# EAGLE design bpod_stepper (EAGLE 9.6.2)
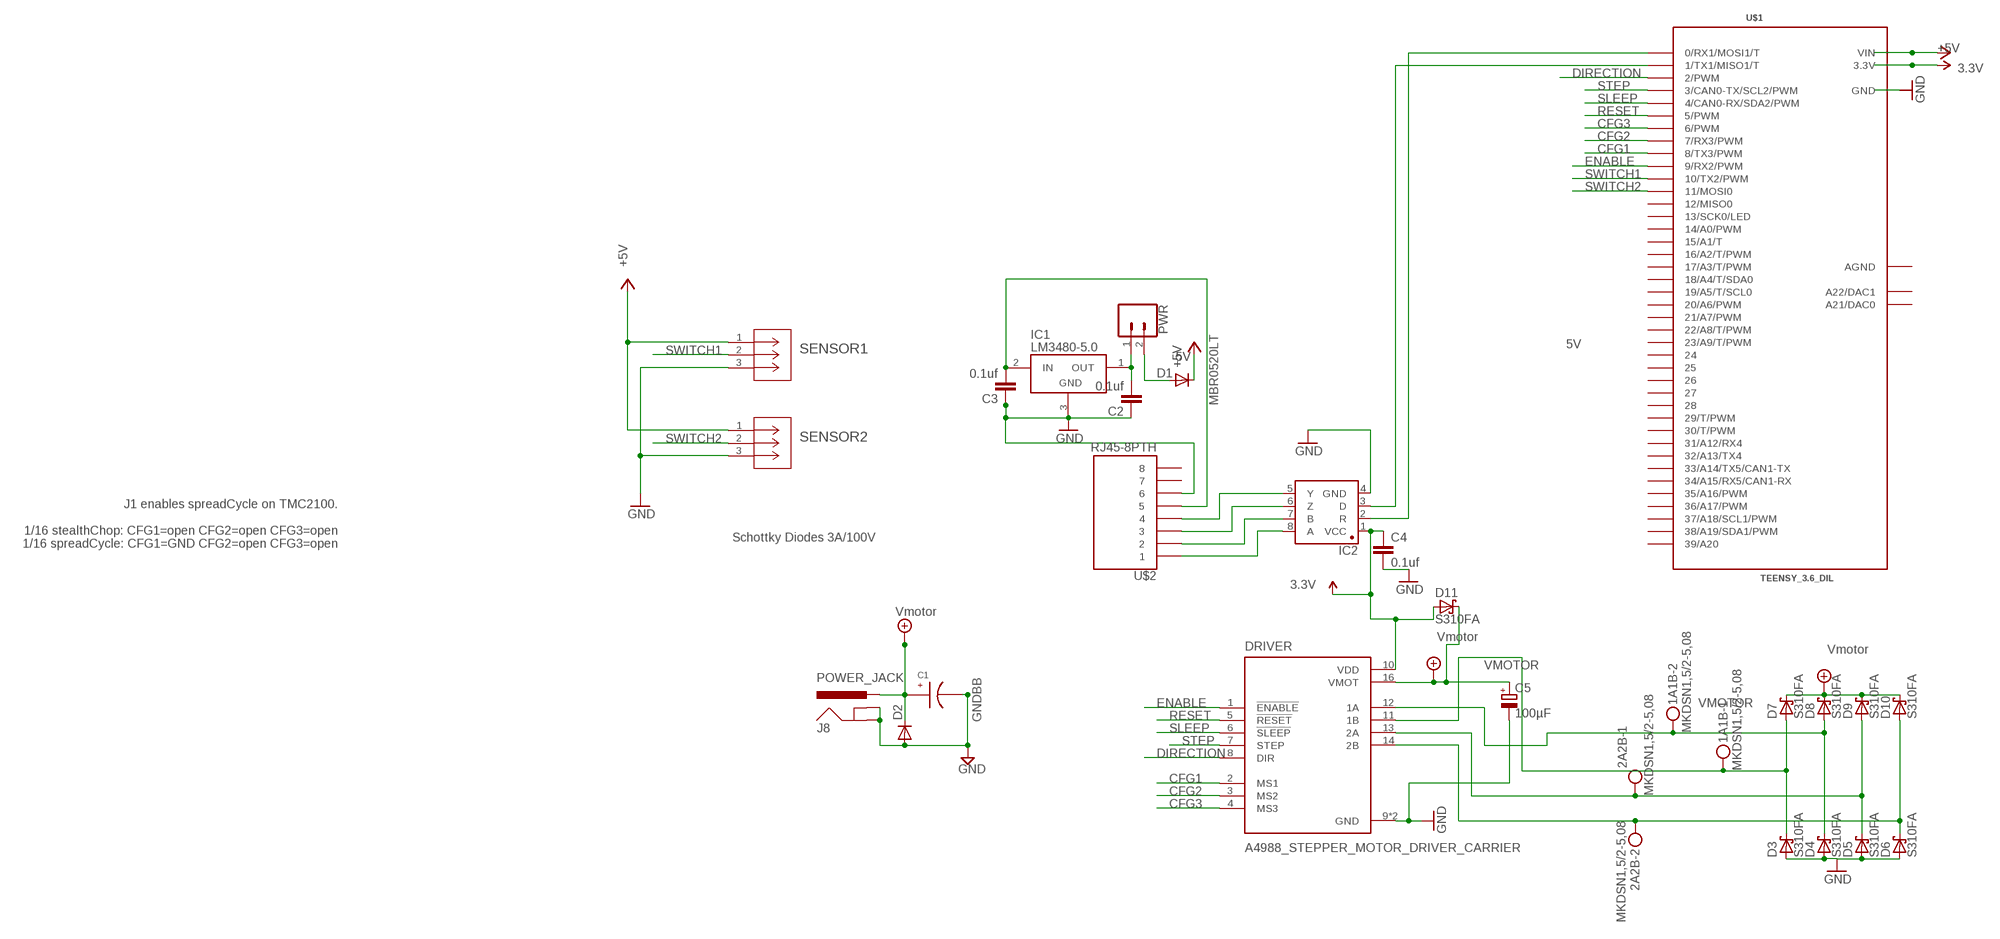
[diagram p0: schematic, sheet 1]

## Parts
1A1B  MKDSN1,5/2-5,08  [MKDSN1,5/2-5,08]
2A2B  MKDSN1,5/2-5,08  [MKDSN1,5/2-5,08]
C1  EEE-FK1H100UR  [EEE-FK1H100UR]
C2  0.1uf  CAP1206  [1206@1]
C3  0.1uf  CAP1206  [1206@1]
C4  0.1uf  CAP1206  [1206@1]
C5  100µF  CPOL-EUE2,5-6E  [E2,5-6E]
D1  MBR0520LT  [SOD123]
D2  DIODE-DO214AA  [DO214AA]
D3  S310FA  D_SCHOTTKY-SOD123  [SOD123]
D4  S310FA  D_SCHOTTKY-SOD123  [SOD123]
D5  S310FA  D_SCHOTTKY-SOD123  [SOD123]
D6  S310FA  D_SCHOTTKY-SOD123  [SOD123]
D7  S310FA  D_SCHOTTKY-SOD123  [SOD123]
D8  S310FA  D_SCHOTTKY-SOD123  [SOD123]
D9  S310FA  D_SCHOTTKY-SOD123  [SOD123]
D10  S310FA  D_SCHOTTKY-SOD123  [SOD123]
D11  S310FA  D_SCHOTTKY-SOD123  [SOD123]
DRIVER  A4988_STEPPER_MOTOR_DRIVER_CARRIER  [MODULE_A4988_STEPPER_MOTOR_DRIVER_CARRIER]
IC1  LM3480-5.0  [SOT-23-3]
IC2  SN65HVD31DR  [SO08]
J8  POWER_JACK  [POWER_JACK_PTH]
PWR  CONN_02  [1X02]
SENSOR1  282834-3  [CONN_282834-3_TYC]
SENSOR2  282834-3  [CONN_282834-3_TYC]
U$1  TEENSY_3.6_DIL  [TEENSY_3.6_DIL]
U$2  RJ45-8PTH  [RJ45-8]

## Nets
3.3V: C4.1 D11.A DRIVER.10(VDD) IC2.1(VCC) U$1.3.3V U$1.3.3V3(3.3V)
+5V: D1.C SENSOR1.1 SENSOR2.1 U$1.VIN
CFG1: DRIVER.2(MS1) U$1.8(8/TX3/PWM)
CFG2: DRIVER.3(MS2) U$1.7(7/RX3/PWM)
CFG3: DRIVER.4(MS3) U$1.6(6/PWM)
DIRECTION: DRIVER.8(DIR) U$1.2(2/PWM)
ENABLE: DRIVER.1(!ENABLE) U$1.9(9/RX2/PWM)
GND: C1.CATHODE C2.1 C3.1 C4.2 C5.- D2.A D3.A D4.A D5.A D6.A DRIVER.9(GND) DRIVER.15(GND) IC1.3(GND) IC2.4(GND) J8.GND J8.GNDBREAK SENSOR1.3 SENSOR2.3 U$2.6
M1A1: 1A1B.1 D3.C D7.A DRIVER.11(1B)
M1B1: 1A1B.2 D4.C D8.A DRIVER.12(1A)
M2A1: 2A2B.1 D5.C D9.A DRIVER.13(2A)
M2B1: 2A2B.2 D6.C D10.A DRIVER.14(2B)
N$7: IC2.8(A) U$2.1
N$8: IC2.7(B) U$2.2
N$9: IC2.6(Z) U$2.3
N$10: IC2.5(Y) U$2.4
N$14: C2.2 IC1.1(OUT) PWR.1
N$18: D1.A PWR.2
N$24: C3.2 IC1.2(IN) U$2.5
RESET: DRIVER.5(!RESET) U$1.5(5/PWM)
RX1: IC2.2(R) U$1.0(0/RX1/MOSI1/T)
SLEEP: DRIVER.6(!SLEEP) U$1.4(4/CAN0-RX/SDA2/PWM)
STEP: DRIVER.7(STEP) U$1.3(3/CAN0-TX/SCL2/PWM)
SWITCH1: SENSOR1.2 U$1.10(10/TX2/PWM)
SWITCH2: SENSOR2.2 U$1.11(11/MOSI0)
TX1: IC2.3(D) U$1.1(1/TX1/MISO1/T)
VMOTOR: C1.ANODE C5.+ D2.C D7.C D8.C D9.C D10.C D11.C DRIVER.16(VMOT) J8.PWR ; supply symbol labelled Vmotor
Unconnected: U$1.12(12/MISO0) U$1.13(13/SCK0/LED) U$1.14/A0(14/A0/PWM) U$1.15/A1(15/A1/T) U$1.16/A2(16/A2/T/PWM) U$1.17/A3(17/A3/T/PWM) U$1.18/A4(18/A4/T/SDA0) U$1.19/A5(19/A5/T/SCL0) U$1.20/A6(20/A6/PWM) U$1.21/A7(21/A7/PWM) U$1.22/A8(22/A8/T/PWM) U$1.23/A9(23/A9/T/PWM) U$1.24 U$1.25 U$1.26 U$1.27 U$1.28 U$1.29(29/T/PWM) U$1.30(30/T/PWM) U$1.31/A12(31/A12/RX4) U$1.32/A13(32/A13/TX4) U$1.33/A14(33/A14/TX5/CAN1-TX) U$1.34/A15(34/A15/RX5/CAN1-RX) U$1.35/A16(35/A16/PWM) U$1.36/A17(36/A17/PWM) U$1.37/A18(37/A18/SCL1/PWM) U$1.38/A19(38/A19/SDA1/PWM) U$1.39/A20 U$1.A21(A21/DAC0) U$1.A22(A22/DAC1) U$2.7 U$2.8

## Notes on the sheet
- 5V
- 5V
- J1 enables spreadCycle on TMC2100.
  
  1/16 stealthChop: CFG1=open CFG2=open CFG3=open
  1/16 spreadCycle: CFG1=GND CFG2=open CFG3=open
- Schottky Diodes 3A/100V
- GNDBB

## Power pins joined to a net without a drawn wire
AGND: U$1.AGND
GND: U$1.GND U$1.GND1(GND)

## Library data of the parts
1A1B 2A2B = con-phoenix-508:MKDSN1,5/2-5,08: MKDSN 1,5/ 2-5,08 Printklemme Nennstrom: 13,5 A Nennspannung: 250 V Rastermaß: 5,08 mm Polzahl: 2 Anschlussart: Schraubanschluss Montage: Löten Anschlussrichtung Leiter/Platine: 0 ° Artikelnummer: 1729128 Source: http://eshop.phoenixcontact.com .. 1729128.pdf
C1 = JoshParts10:EEE-FK1H100UR
C2-C4 = SparkFun-Capacitors:CAP: Capacitor Standard 0603 ceramic capacitor, and 0.1" leaded capacitor.
C5 = rcl:CPOL-EU: POLARIZED CAPACITOR, European symbol; SPICEPREFIX: C
D1 = diode:MBR0520LT: SCHOTTKY BARRIER RECTIFIER Source: http://onsemi.com .. MBR0520LT1-D.pdf
D2 = diode:DIODE-: DIODE
D3-D11 = we-rcl:D_SCHOTTKY: Schottky Diodes 1A, 30V - SOD323 (BAS3010 or CUS10S40) 2A, 30V - SMA/DO214AC 10A,45V - Z5-T (CDBZ5T1045)
DRIVER = A4988_STEPPER_MOTOR_DRIVER_CARRIER:A4988_STEPPER_MOTOR_DRIVER_CARRIER: Stepper motor controler; IC: A4988; 1A; Uin mot: 8÷35V; AVAILABILITY: Unavailable; DESCRIPTION: Stepper Motor Driver; MF: Pololu; MP: A4988 STEPPER MOTOR DRIVER CARRIER; PACKAGE: None; PRICE: None
IC1 = regulators:LM3480-*: National Semiconductor LM3480 100 mA, SOT-23, quasi-LDO linear regulator
IC2 = Joshparts4:SN65HVD31DR: A placeholder for generic narrow & wide SOIC8 foorptints - used on the DIP adapter board.
J8 = SparkFun-Connectors:POWER_JACK: Power Jack Connector This is the standard 5.5mm barrel jack for power. The PTH is the most common, proven, reliable, footprint. The Slot footprint only works if the mill layer is transmitted to the PCB fab house so be warned. Here are the connectors we sell at SparkFun: DC Barrel Power Jack/Connector <https://www.sparkfun.com/products/119> (PRT-00119) DC Barrel Power Jack/Connector (SMD) <https://www.sparkfun.com/products/12748> (PRT-12748) DC Barrel Jack Adapter - Breadboard Compatible <https://www.sparkfun.com/products/10811> (PRT-10811) It is used on this SparkFun product (and many, many others): SparkFun RedBoard - Programmed with Arduino <https://www.sparkfun.com/products/12757> (DEV-12757) Also, if you need a mating power supply or connector, please check these out: Wall Adapter Power Supply - 9VDC 650mA <https://www.sparkfun.com/products/298> (TOL-00298) DC Barrel Jack Adapter - Male <https://www.sparkfun.com/products/10287> (PRT-10287); PROD_ID: CONN-08197
PWR = SparkFun-Connectors:CONN_02: Multi connection point. Often used as Generic Header-pin footprint for 0.1 inch spaced/style header connections On any of the 0.1 inch spaced packages, you can populate with these: Break Away Headers - Straight <https://www.sparkfun.com/products/116> (PRT-00116) Break Away Male Headers - Right Angle <https://www.sparkfun.com/products/553> (PRT-00553) Female Headers <https://www.sparkfun.com/products/115> (PRT-00115) Break Away Headers - Machine Pin <https://www.sparkfun.com/products/117> (PRT-00117) Break Away Female Headers - Swiss Machine Pin <https://www.sparkfun.com/products/743> (PRT-00743) For SCREWTERMINALS and SPRING TERMINALS visit here: Screw Terimnals on SparkFun.com <https://www.sparkfun.com/search/results?term=Screw+Terminals> (5mm/3.5mm/2.54mm spacing) This device is also useful as a general connection point to wire up your design to another part of your project. Our various solder wires solder well into these plated through hole pads. Hook-Up Wire - Assortment (Stranded, 22 AWG) <https://www.sparkfun.com/products/11375> (PRT-11375) Hook-Up Wire - Assortment (Solid Core, 22 AWG) <https://www.sparkfun.com/products/11367> (PRT-11367) View the entire wire category on our website here <https://www.sparkfun.com/categories/141> Special notes: Molex polarized connector foot print use with: PRT-08233 with associated crimp pins and housings. 2.54_SCREWTERM for use with PRT-10571. 3.5mm Screw Terminal footprints for PRT-08084 5mm Screw Terminal footprints for use with PRT-08432
SENSOR1 SENSOR2 = 254mm 3pin Schraubterminal:282834-3; BUILT_BY: EMA_UL_Team; COPYRIGHT: Copyright (C) 2016 Accelerated Designs. All rights reserved; MANUFACTURER_PART_NUMBER: 282834-3; SOURCELIBRARY: Tyco_2012-06-25; VENDOR: TE Connectivity
U$1 = Teensy_3_and_LC_Series_Boards_v1.4:TEENSY_3.6_DIL: Teensy 3.6 DIL Package
U$2 = SparkFun:RJ45-8: RJ45 Jack Simple RJ45, 8-pin connection - connector for common Cat5, Cat5e, and Cat6 Ethernet cables. Footprint not yet proven in production. Connector sku is PRT-00643; Breakout PCB sku is BOB-00716.

## Board
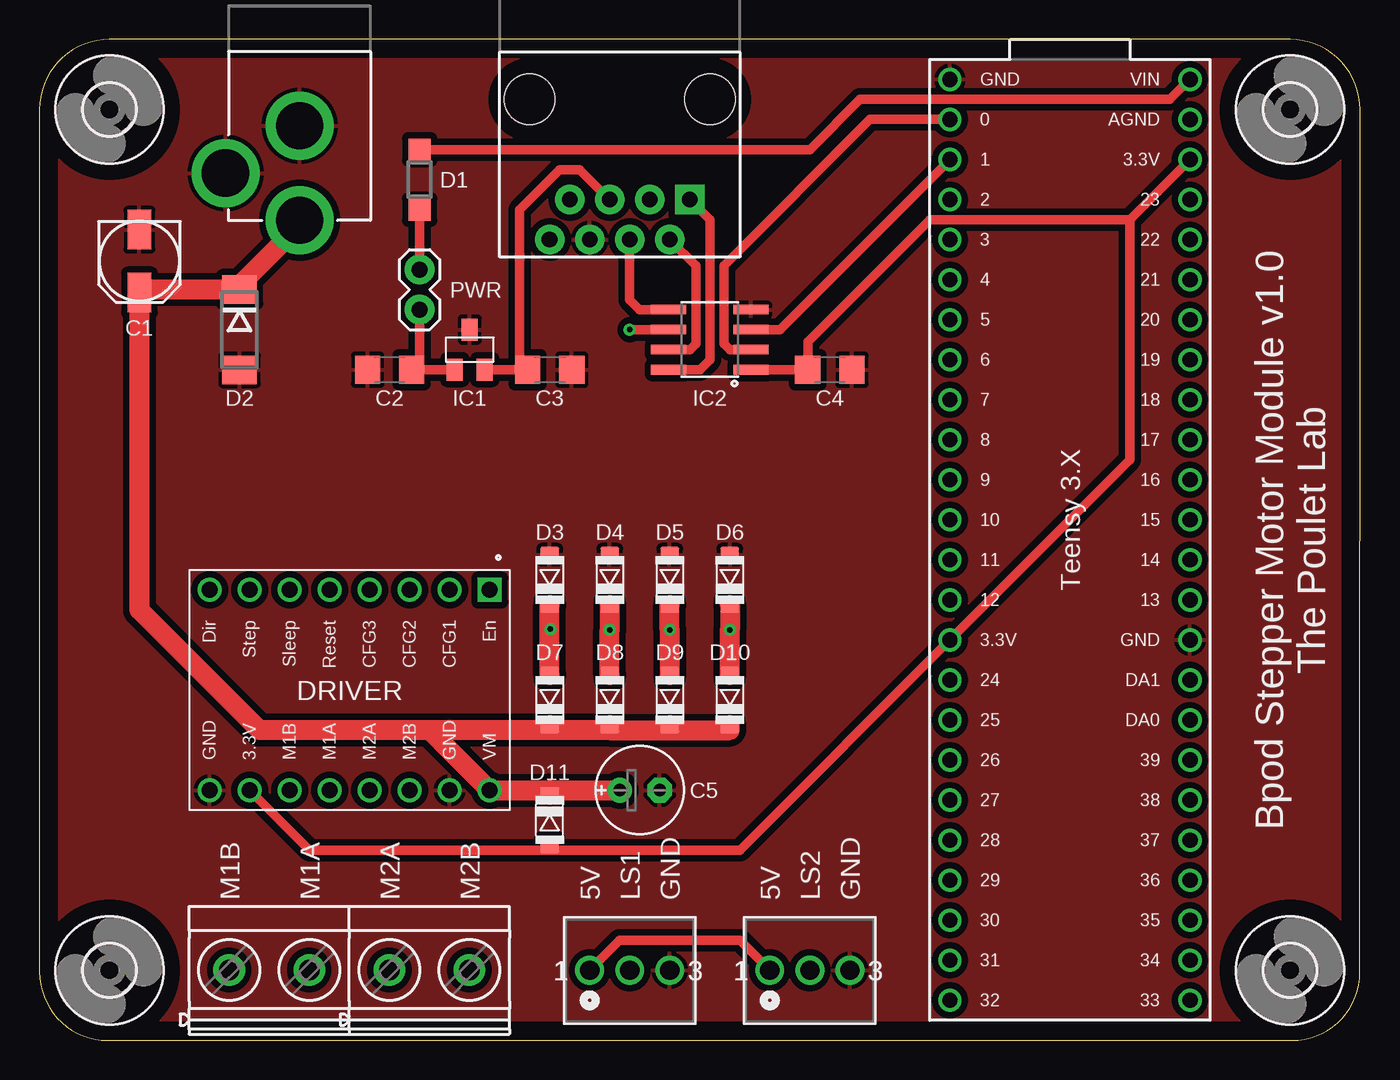
[diagram p1: board, top side]
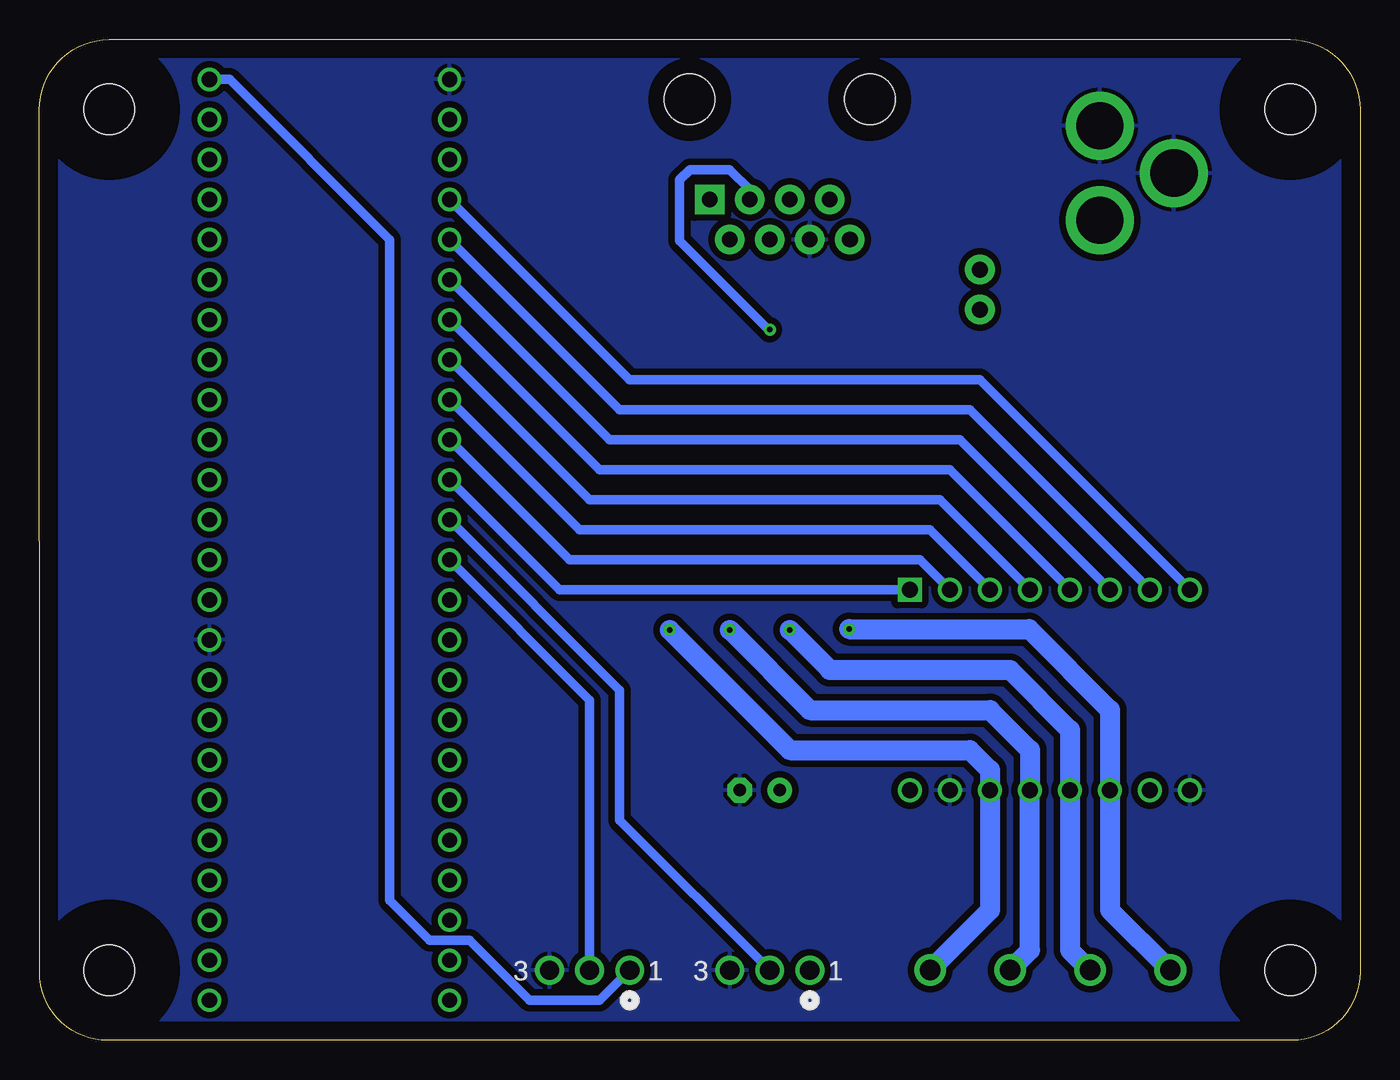
[diagram p2: board, bottom side, seen from below]

Size 83.82 x 63.5 mm. Coordinates in mm from the lower left corner, seen from the top.
Outline: 79.38,63.5 4.45,63.5 arc90 0,59.05 0,4.34 arc90 4.34,0 79.5,0 arc90 83.8,4.3 83.82,59.05 arc90 79.38,63.5
Copper layers (1*16): Top 0.035mm / dielectric 1.5mm / Bottom 0.035mm
Design rules "default": minimum track width 6mil, minimum drill 0.35mm, track to track 6mil, track to pad 6mil, pad to pad 6mil, via to via 6mil, smd to smd 6mil, copper to edge 40mil, drill to drill 6mil, minimum pad ring 10mil, minimum via ring 8mil, stop-mask expansion 4mil, vias tented up to drill 0mil, thermal gap 10mil

### Footprints (pad centres in the part's own frame; a part is rotated, then mirrored left to right if it is on the bottom)
MKDSN1,5/2-5,08 = drill 1.3 pad 2: 1 -2.561,0.025; 2 2.519,0.025
EEE-FK1H100UR = smd 1.5 x 2.5: ANODE 0,4; CATHODE 0,0
1206@1 = smd 1.6 x 1.8: 1 -1.4,0; 2 1.4,0
E2,5-6E = drill 0.813 pad 1.575: + -1.27,0 | drill 0.813 pad 1.575 octagon: - 1.27,0
SOD123 = smd 1.4 x 1.4: A 1.9,0; C -1.9,0
DO214AA = smd 1.8 x 2.2: A 2.55,0; C -2.55,0
SOD123' = smd 1.2 x 1: A 0,-1.6; C 0,1.6
MODULE_A4988_STEPPER_MOTOR_DRIVER_CARRIER = drill 1.02 square: 1 -6.35,8.89 | drill 1.02: 2 -6.35,6.35; 3 -6.35,3.81; 4 -6.35,1.27; 5 -6.35,-1.27; 6 -6.35,-3.81; 7 -6.35,-6.35; 8 -6.35,-8.89; 9 6.35,-8.89; 10 6.35,-6.35; 11 6.35,-3.81; 12 6.35,-1.27; 13 6.35,1.27; 14 6.35,3.81; 15 6.35,6.35; 16 6.35,8.89
SOT-23-3 = smd 1.016 x 1.397: 1 -0.953,-1.27; 2 0.953,-1.27; 3 0,1.27
SO08 = smd 0.61 x 2.21: 1 -1.905,-2.616; 2 -0.635,-2.616; 3 0.635,-2.616; 4 1.905,-2.616; 5 1.905,2.616; 6 0.635,2.616; 7 -0.635,2.616; 8 -1.905,2.616
POWER_JACK_PTH = drill 2.997 pad 4.318: GND 0,7.7; GNDBREAK 4.7,10.7; PWR 0,13.7
1X02 = drill 1.016 pad 1.88: 1 0,0; 2 2.54,0
CONN_282834-3_TYC = drill 1.219 pad 1.727: 1 0,0; 2 2.54,0; 3 5.08,0
TEENSY_3.6_DIL = drill 0.965: 0 -7.62,25.4; 1 -7.62,22.86; 2 -7.62,20.32; 3 -7.62,17.78; 3.3V 7.62,22.86; 3.3V3 -7.62,-7.62; 4 -7.62,15.24; 5 -7.62,12.7; 6 -7.62,10.16; 7 -7.62,7.62; 8 -7.62,5.08; 9 -7.62,2.54; 10 -7.62,0; 11 -7.62,-2.54; 12 -7.62,-5.08; 13 7.62,-5.08; 14/A0 7.62,-2.54; 15/A1 7.62,0; 16/A2 7.62,2.54; 17/A3 7.62,5.08; 18/A4 7.62,7.62; 19/A5 7.62,10.16; 20/A6 7.62,12.7; 21/A7 7.62,15.24; 22/A8 7.62,17.78; 23/A9 7.62,20.32; 24 -7.62,-10.16; 25 -7.62,-12.7; 26 -7.62,-15.24; 27 -7.62,-17.78; 28 -7.62,-20.32; 29 -7.62,-22.86; 30 -7.62,-25.4; 31/A12 -7.62,-27.94; 32/A13 -7.62,-30.48; 33/A14 7.62,-30.48; 34/A15 7.62,-27.94; 35/A16 7.62,-25.4; 36/A17 7.62,-22.86; 37/A18 7.62,-20.32; 38/A19 7.62,-17.78; 39/A20 7.62,-15.24; A21 7.62,-12.7; A22 7.62,-10.16; AGND 7.62,25.4; GND -7.62,27.94; GND1 7.62,-7.62; VIN 7.62,27.94
RJ45-8 = drill 1 pad 1.88 square: 1 -4.445,6.35 | drill 1 pad 1.88: 2 -3.175,8.89; 3 -1.905,6.35; 4 -0.635,8.89; 5 0.635,6.35; 6 1.905,8.89; 7 3.175,6.35; 8 4.445,8.89 | hole 3.2: -5.715,0; 5.715,0
3,2 = hole 3.2: 0,0

### Placement (x,y rotation side)
1A1B  14.61,4.45 0 top
2A2B  24.77,4.45 0 top
C1  6.35,51.44 180 top
C2  22.23,42.55 0 top
C3  32.38,42.55 180 top
C4  50.16,42.55 0 top
C5  38.1,15.88 0 top
D1  24.13,54.61 270 top
D2  12.7,45.09 270 top
D3  S310FA  [SOD123']  32.38,29.21 180 top
D4  S310FA  [SOD123']  36.2,29.21 180 top
D5  S310FA  [SOD123']  40.01,29.21 180 top
D6  S310FA  [SOD123']  43.81,29.21 180 top
D7  S310FA  [SOD123']  32.38,21.59 180 top
D8  S310FA  [SOD123']  36.2,21.59 180 top
D9  S310FA  [SOD123']  40.01,21.59 180 top
D10  S310FA  [SOD123']  43.81,21.59 180 top
D11  S310FA  [SOD123']  32.38,13.97 0 top
DRIVER  19.68,22.23 270 top
IC1  27.3,43.81 0 top
IC2  42.55,44.45 90 top
J8  16.51,65.72 180 top
PWR  24.13,46.35 90 top
SENSOR1  34.92,4.45 0 top
SENSOR2  46.35,4.45 0 top
U$1  65.41,33.02 0 top
U$2  36.83,59.69 180 top
U$7  [3,2]  4.45,4.45 0 top
U$8  [3,2]  4.45,59.05 0 top
U$9  [3,2]  79.38,59.05 0 top
U$10  [3,2]  79.38,4.45 0 top

### Tracks (layer width: path | path; a pad name or v marks a point on that pad's centre or on a via)
3.3V
  Top 0.61: 32.38,12.06 44.45,12.06 U$1.3.3V3 69.22,36.83 69.22,52.07 | D11.A 32.38,12.06 | 32.38,12.06 17.14,12.06 DRIVER.10 | U$1.3.3V 69.22,52.07 | IC2.1 C4.1 48.77,44.32 56.52,52.07 69.22,52.07
+5V
  Top 0.61: D1.C 48.9,56.52 52.07,59.69 71.75,59.69 U$1.VIN | SENSOR2.1 44.45,6.35 36.83,6.35 SENSOR1.1
  Bottom 0.61: U$1.VIN 71.75,60.96 61.59,50.8 61.59,8.89 59.05,6.35 56.52,6.35 52.7,2.54 48.26,2.54 SENSOR2.1
CFG1
  Bottom 0.61: DRIVER.2 27.94,30.48 50.16,30.48 U$1.8
CFG2
  Bottom 0.61: DRIVER.3 27.3,32.38 49.53,32.38 U$1.7
CFG3
  Bottom 0.61: U$1.6 48.9,34.29 26.67,34.29 DRIVER.4
DIRECTION
  Bottom 0.61: U$1.2 46.35,41.91 24.13,41.91 DRIVER.8
ENABLE
  Bottom 0.61: DRIVER.1 50.8,28.57 U$1.9
GND
  pour Bottom (isolate 0.406): 79.38,62.23 4.45,62.23 arc90 1.27,59.05 1.27,4.45 arc90 4.45,1.27 79.38,1.27 arc90 82.55,4.45 82.55,59.05 arc90
  pour Top (isolate 0.406): 1.27,4.45 1.27,59.05 arc-90 4.45,62.23 79.38,62.23 arc-90 82.55,59.05 82.55,4.45 arc-90 79.38,1.27 4.45,1.27 arc-90
M1A1  (via drill 0.35)
  Top 0.61: D3.C 32.43,27.56 v32.43,26.08
  Top 1.27: D7.A D3.C
  Bottom 1.27: v32.43,26.08 21,26.08 15.88,20.95 DRIVER.11 15.88,8.26 12.09,4.47 1A1B.1
M1B1  (via drill 0.35)
  Top 1.27: D8.A v36.2,26.04 D4.C
  Bottom 1.27: v36.2,26.04 33.66,23.5 22.23,23.5 18.41,19.68 DRIVER.12 18.41,5.71 17.17,4.47 1A1B.2
M2A1  (via drill 0.35)
  Top 1.27: D5.C v40.01,26.04 D9.A
  Bottom 0.61: 2A2B.1
  Bottom 1.27: 2A2B.1 20.95,5.71 DRIVER.13 20.95,18.41 23.5,20.95 34.92,20.95 v40.01,26.04
M2B1  (via drill 0.35)
  Top 1.27: D6.C v43.81,26.04 D10.A
  Bottom 1.27: 2A2B.2 23.5,8.26 DRIVER.14 23.5,17.14 24.77,18.41 36.2,18.41 v43.81,26.04
N$7
  Top 0.61: IC2.8 41.91,42.55 42.55,43.18 42.55,52.07 U$2.1
N$8
  Top 0.61: IC2.7 41.27,43.81 41.66,44.2 41.66,49.15 U$2.2
N$9  (via drill 0.35)
  Top 0.61: IC2.6 v37.47,45.09
  Bottom 0.61: v37.47,45.09 37.54,45.09 43.18,50.73 43.18,54.6 42.53,55.24 40.02,55.24 38.73,53.96 U$2.3
N$10
  Top 0.61: IC2.5 38.1,46.35 37.47,46.99 U$2.4
N$14
  Top 0.61: PWR.1 24.13,42.55 C2.2 IC1.1
N$18
  Top 0.61: D1.A PWR.2
N$24
  Top 0.61: IC1.2 C3.2 30.48,42.55 30.48,52.7 33.02,55.24 34.29,55.24 U$2.5
RESET
  Bottom 0.61: U$1.5 48.26,36.2 26.04,36.2 DRIVER.5
RX1
  Top 0.61: IC2.2 43.81,43.81 43.43,44.2 43.43,49.15 52.7,58.42 U$1.0
SLEEP
  Bottom 0.61: U$1.4 47.62,38.1 25.4,38.1 DRIVER.6
STEP
  Bottom 0.61: DRIVER.7 24.77,40.01 46.99,40.01 U$1.3
SWITCH1
  Bottom 0.61: U$1.10 46.99,22.23 46.99,13.97 SENSOR1.2
SWITCH2
  Bottom 0.61: U$1.11 48.9,21.59 SENSOR2.2
TX1
  Top 0.61: IC2.3 46.99,45.09 U$1.1
VMOTOR
  Top 0.61: 6.35,47.62 6.34,47.63 | C1.ANODE
  Top 1.27: J8.PWR 16.51,51.7 12.7,47.9 D2.C 6.35,47.62 | 6.34,47.63 C1.ANODE 6.34,27.32 13.97,19.68 24.77,19.68 | D7.C 32.38,19.68 | 32.38,19.68 24.77,19.68 | 24.77,19.68 DRIVER.16 32.38,15.88 | D10.C 43.81,19.68 40.31,19.68 | D8.C 36.2,19.68 | 36.2,19.68 32.38,19.68 | 36.2,19.68 40.31,19.68 | 40.31,19.68 D9.C | 32.38,15.88 C5.+ | D11.C 32.38,15.88

### Text on the board
tNames: GND | VIN | 0 | AGND | 1 | 3.3V | 2 | 23 | 3 | 22 | 4 | 21 | 5 | 20 | 6 | 19 | 7 | 18 | 8 | 17 | 9 | 16 | 10 | Teensy 3.X | 15 | Bpod Stepper Motor Module v1.0 / The Poulet Lab | 11 | 14 | 12 | 13 | Dir | Step | Sleep | Reset | CFG3 | CFG2 | CFG1 | En | 3.3V | GND | 24 | DA1 | 25 | DA0 | GND | 3.3V | M1B | M1A | M2A | M2B | GND | VM | 26 | 39 | 27 | 38 | 28 | 37 | 29 | 36 | M1B | M1A | M2A | M2B | 5V | LS1 | GND | 5V | LS2 | GND | 30 | 35 | 31 | 34 | 32 | 33